# Altium project LimeSDR_1v2s.PrjPcb (part 2 of 4)

## Sheet 09_FPGA_misc.SchDoc: FPGA misc (power, clocks, config)
size A3; Organization: Lime Microsystems; Address1: Surrey Tech Centre; Address2: Guildford GU2 7YG; Address3: Surrey; Address4: United Kingdom; Revision: v1.2; SheetNumber: 9; SheetTotal: 14
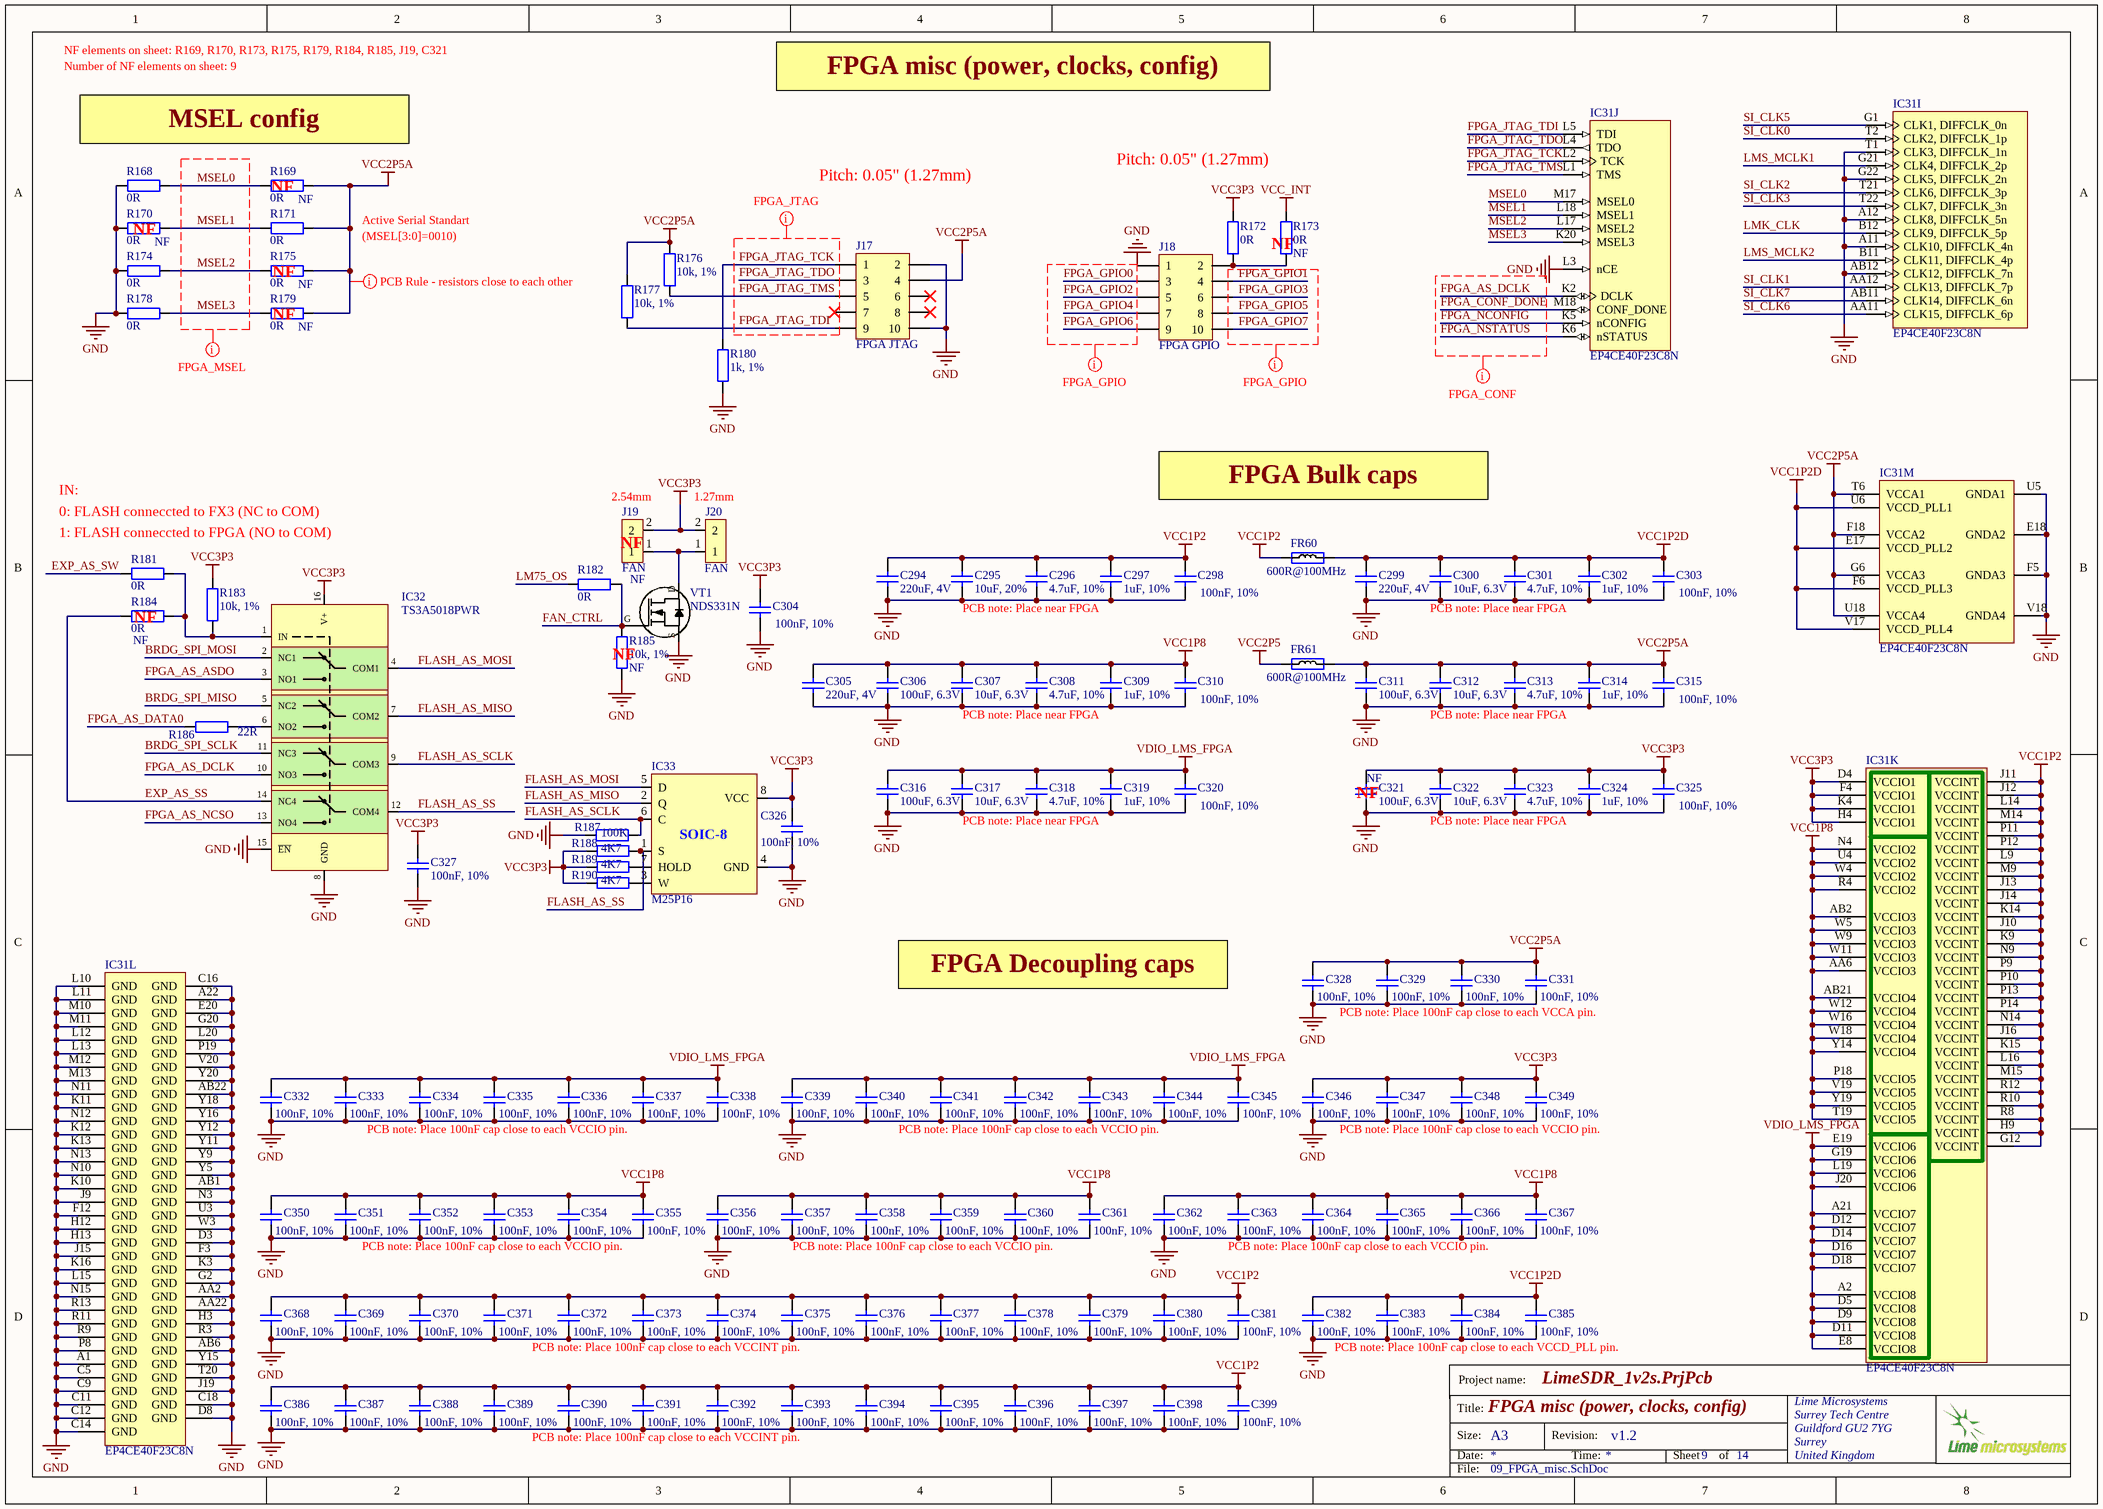
[diagram p7: 09_FPGA_misc.SchDoc]

### Parts
C294  220uF, 4V  [CAP1206]
C295  10uF, 20%  [CAP0603]
C296  4.7uF, 10%  [CAP0603]
C297  1uF, 10%  [CAP0402]
C298  100nF, 10%  [CAP0402]
C299  220uF, 4V  [CAP1206]
C300  10uF, 6.3V  [CAP0603]
C301  4.7uF, 10%  [CAP0603]
C302  1uF, 10%  [CAP0402]
C303  100nF, 10%  [CAP0402]
C304  100nF, 10%  [CAP0402]
C305  220uF, 4V  [CAP1206]
C306  100uF, 6.3V  [CAP1206]
C307  10uF, 6.3V  [CAP0603]
C308  4.7uF, 10%  [CAP0603]
C309  1uF, 10%  [CAP0402]
C310  100nF, 10%  [CAP0402]
C311  100uF, 6.3V  [CAP1206]
C312  10uF, 6.3V  [CAP0603]
C313  4.7uF, 10%  [CAP0603]
C314  1uF, 10%  [CAP0402]
C315  100nF, 10%  [CAP0402]
C316  100uF, 6.3V  [CAP1206]
C317  10uF, 6.3V  [CAP0603]
C318  4.7uF, 10%  [CAP0603]
C319  1uF, 10%  [CAP0402]
C320  100nF, 10%  [CAP0402]
C321  100uF, 6.3V  Assembly Info: NF  [CAP1206]
C322  10uF, 6.3V  [CAP0603]
C323  4.7uF, 10%  [CAP0603]
C324  1uF, 10%  [CAP0402]
C325  100nF, 10%  [CAP0402]
C326  100nF, 10%  [CAP0402]
C327  100nF, 10%  [CAP0402]
C328  100nF, 10%  [CAP0402]
C329  100nF, 10%  [CAP0402]
C330  100nF, 10%  [CAP0402]
C331  100nF, 10%  [CAP0402]
C332  100nF, 10%  [CAP0402]
C333  100nF, 10%  [CAP0402]
C334  100nF, 10%  [CAP0402]
C335  100nF, 10%  [CAP0402]
C336  100nF, 10%  [CAP0402]
C337  100nF, 10%  [CAP0402]
C338  100nF, 10%  [CAP0402]
C339  100nF, 10%  [CAP0402]
C340  100nF, 10%  [CAP0402]
C341  100nF, 10%  [CAP0402]
C342  100nF, 10%  [CAP0402]
C343  100nF, 10%  [CAP0402]
C344  100nF, 10%  [CAP0402]
C345  100nF, 10%  [CAP0402]
C346  100nF, 10%  [CAP0402]
C347  100nF, 10%  [CAP0402]
C348  100nF, 10%  [CAP0402]
C349  100nF, 10%  [CAP0402]
C350  100nF, 10%  [CAP0402]
C351  100nF, 10%  [CAP0402]
C352  100nF, 10%  [CAP0402]
C353  100nF, 10%  [CAP0402]
C354  100nF, 10%  [CAP0402]
C355  100nF, 10%  [CAP0402]
C356  100nF, 10%  [CAP0402]
C357  100nF, 10%  [CAP0402]
C358  100nF, 10%  [CAP0402]
C359  100nF, 10%  [CAP0402]
C360  100nF, 10%  [CAP0402]
C361  100nF, 10%  [CAP0402]
C362  100nF, 10%  [CAP0402]
C363  100nF, 10%  [CAP0402]
C364  100nF, 10%  [CAP0402]
C365  100nF, 10%  [CAP0402]
C366  100nF, 10%  [CAP0402]
C367  100nF, 10%  [CAP0402]
C368  100nF, 10%  [CAP0402]
C369  100nF, 10%  [CAP0402]
C370  100nF, 10%  [CAP0402]
C371  100nF, 10%  [CAP0402]
C372  100nF, 10%  [CAP0402]
C373  100nF, 10%  [CAP0402]
C374  100nF, 10%  [CAP0402]
C375  100nF, 10%  [CAP0402]
C376  100nF, 10%  [CAP0402]
C377  100nF, 10%  [CAP0402]
C378  100nF, 10%  [CAP0402]
C379  100nF, 10%  [CAP0402]
C380  100nF, 10%  [CAP0402]
C381  100nF, 10%  [CAP0402]
C382  100nF, 10%  [CAP0402]
C383  100nF, 10%  [CAP0402]
C384  100nF, 10%  [CAP0402]
C385  100nF, 10%  [CAP0402]
C386  100nF, 10%  [CAP0402]
C387  100nF, 10%  [CAP0402]
C388  100nF, 10%  [CAP0402]
C389  100nF, 10%  [CAP0402]
C390  100nF, 10%  [CAP0402]
C391  100nF, 10%  [CAP0402]
C392  100nF, 10%  [CAP0402]
C393  100nF, 10%  [CAP0402]
C394  100nF, 10%  [CAP0402]
C395  100nF, 10%  [CAP0402]
C396  100nF, 10%  [CAP0402]
C397  100nF, 10%  [CAP0402]
C398  100nF, 10%  [CAP0402]
C399  100nF, 10%  [CAP0402]
FR60  600R@100MHz  [RES0805]
FR61  600R@100MHz  [RES0805]
IC31  EP4CE40F23C8N  [FBGA484_A-240]  (parts I,J,K,L,M of 13)
IC32  TS3A5018PWR  [TS3A5018PWR]
IC33  M25P16  [M25P40-VMN6TPB_SO8N]
J17  FPGA JTAG  [SWD_10_pin]
J18  FPGA GPIO  [SWD_10_pin]
J19  FAN  Assembly Info: NF  [HDR_1x2]
J20  FAN  [HDR_1x2_HALF_PITCH]
R168  0R  [RES0402]
R169  0R  Assembly Info: NF  [RES0402]
R170  0R  Assembly Info: NF  [RES0402]
R171  0R  [RES0402]
R172  0R  [RES0402]
R173  0R  Assembly Info: NF  [RES0402]
R174  0R  [RES0402]
R175  0R  Assembly Info: NF  [RES0402]
R176  10k, 1%  [RES0402]
R177  10k, 1%  [RES0402]
R178  0R  [RES0402]
R179  0R  Assembly Info: NF  [RES0402]
R180  1k, 1%  [RES0402]
R181  0R  [RES0402]
R182  0R  [RES0402]
R183  10k, 1%  [RES0402]
R184  0R  Assembly Info: NF  [RES0402]
R185  10k, 1%  Assembly Info: NF  [RES0402]
R186  22R  [RES0402]
R187  100K  [RES0402]
R188  4K7  [RES0402]
R189  4K7  [RES0402]
R190  4K7  [RES0402]
VT1  NDS331N  [SOT23-3]

### Nets
GND: C294.1 C295.1 C296.1 C297.2 C298.2 C299.1 C300.1 C301.1 C302.2 C303.2 C304.2 C305.1 C306.1 C307.1 C308.1 C309.1 C310.2 C311.1 C312.1 C313.1 C314.1 C315.2 C316.1 C317.1 C318.1 C319.1 C320.2 C321.1 C322.1 C323.1 C324.1 C325.2 C326.2 C327.2 C328.2 C329.2 C330.2 C331.2 C332.2 C333.2 C334.2 C335.2 C336.2 C337.2 C338.2 C339.2 C340.2 C341.2 C342.2 C343.2 C344.2 C345.2 C346.2 C347.2 C348.2 C349.2 C350.2 C351.2 C352.2 C353.2 C354.2 C355.2 C356.2 C357.2 C358.2 C359.2 C360.2 C361.2 C362.2 C363.2 C364.2 C365.2 C366.2 C367.2 C368.2 C369.2 C370.2 C371.2 C372.2 C373.2 C374.2 C375.2 C376.2 C377.2 C378.2 C379.2 C380.2 C381.2 C382.2 C383.2 C384.2 C385.2 C386.2 C387.2 C388.2 C389.2 C390.2 C391.2 C392.2 C393.2 C394.2 C395.2 C396.2 C397.2 C398.2 C399.2 IC31.A1(GND) IC31.A11(CLK10,_DIFFCLK_4n) IC31.A12(CLK8,_DIFFCLK_5n) IC31.A22(GND) IC31.AA2(GND) IC31.AA22(GND) IC31.AB1(GND) IC31.AB6(GND) IC31.AB12(CLK12,_DIFFCLK_7n) IC31.AB22(GND) IC31.C5(GND) IC31.C9(GND) IC31.C11(GND) IC31.C12(GND) IC31.C14(GND) IC31.C16(GND) IC31.C18(GND) IC31.D3(GND) IC31.D8(GND) IC31.E18(GNDA2) IC31.E20(GND) IC31.F3(GND) IC31.F5(GNDA3) IC31.F12(GND) IC31.G2(GND) IC31.G20(GND) IC31.G22(CLK5,_DIFFCLK_2n) IC31.H3(GND) IC31.H12(GND) IC31.H13(GND) IC31.J9(GND) IC31.J15(GND) IC31.J19(GND) IC31.K3(GND) IC31.K10(GND) IC31.K11(GND) IC31.K12(GND) IC31.K13(GND) IC31.K16(GND) IC31.L3(nCE) IC31.L10(GND) IC31.L11(GND) IC31.L12(GND) IC31.L13(GND) IC31.L15(GND) IC31.L20(GND) IC31.M10(GND) IC31.M11(GND) IC31.M12(GND) IC31.M13(GND) IC31.N3(GND) IC31.N10(GND) IC31.N11(GND) IC31.N12(GND) IC31.N13(GND) IC31.N15(GND) IC31.P8(GND) IC31.P19(GND) IC31.R3(GND) IC31.R9(GND) IC31.R11(GND) IC31.R13(GND) IC31.T1(CLK3,_DIFFCLK_1n) IC31.T20(GND) IC31.U3(GND) IC31.U5(GNDA1) IC31.V18(GNDA4) IC31.V20(GND) IC31.W3(GND) IC31.Y5(GND) IC31.Y9(GND) IC31.Y11(GND) IC31.Y12(GND) IC31.Y15(GND) IC31.Y16(GND) IC31.Y18(GND) IC31.Y20(GND) IC32.8(GND) IC32.15(~{EN}) IC33.4(GND) J17.2 J17.10 J18.1 R168.2 R170.2 R174.2 R178.2 R180.2 R185.2 R187.2 VT1.S
VCC1P2: C294.2 C295.2 C296.2 C297.1 C298.1 C368.1 C369.1 C370.1 C371.1 C372.1 C373.1 C374.1 C375.1 C376.1 C377.1 C378.1 C379.1 C380.1 C381.1 C386.1 C387.1 C388.1 C389.1 C390.1 C391.1 C392.1 C393.1 C394.1 C395.1 C396.1 C397.1 C398.1 C399.1 FR60.1 IC31.G12(VCCINT) IC31.H9(VCCINT) IC31.J10(VCCINT) IC31.J11(VCCINT) IC31.J12(VCCINT) IC31.J13(VCCINT) IC31.J14(VCCINT) IC31.J16(VCCINT) IC31.K9(VCCINT) IC31.K14(VCCINT) IC31.K15(VCCINT) IC31.L9(VCCINT) IC31.L14(VCCINT) IC31.L16(VCCINT) IC31.M9(VCCINT) IC31.M14(VCCINT) IC31.M15(VCCINT) IC31.N9(VCCINT) IC31.N14(VCCINT) IC31.P9(VCCINT) IC31.P10(VCCINT) IC31.P11(VCCINT) IC31.P12(VCCINT) IC31.P13(VCCINT) IC31.P14(VCCINT) IC31.R8(VCCINT) IC31.R10(VCCINT) IC31.R12(VCCINT)
VCC1P2D: C299.2 C300.2 C301.2 C302.1 C303.1 C382.1 C383.1 C384.1 C385.1 FR60.2 IC31.E17(VCCD_PLL2) IC31.F6(VCCD_PLL3) IC31.U6(VCCD_PLL1) IC31.V17(VCCD_PLL4)
VCC1P8: C305.2 C306.2 C307.2 C308.2 C309.2 C310.1 C350.1 C351.1 C352.1 C353.1 C354.1 C355.1 C356.1 C357.1 C358.1 C359.1 C360.1 C361.1 C362.1 C363.1 C364.1 C365.1 C366.1 C367.1 IC31.AA6(VCCIO3) IC31.AB2(VCCIO3) IC31.AB21(VCCIO4) IC31.N4(VCCIO2) IC31.P18(VCCIO5) IC31.R4(VCCIO2) IC31.T19(VCCIO5) IC31.U4(VCCIO2) IC31.V19(VCCIO5) IC31.W4(VCCIO2) IC31.W5(VCCIO3) IC31.W9(VCCIO3) IC31.W11(VCCIO3) IC31.W12(VCCIO4) IC31.W16(VCCIO4) IC31.W18(VCCIO4) IC31.Y14(VCCIO4) IC31.Y19(VCCIO5)
VCC2P5: FR61.1
VCC2P5A: C311.2 C312.2 C313.2 C314.2 C315.1 C328.1 C329.1 C330.1 C331.1 FR61.2 IC31.F18(VCCA2) IC31.G6(VCCA3) IC31.T6(VCCA1) IC31.U18(VCCA4) J17.4 R169.1 R171.1 R175.1 R176.2 R177.2 R179.1
VCC3P3: C304.1 C321.2 C322.2 C323.2 C324.2 C325.1 C326.1 C327.1 C346.1 C347.1 C348.1 C349.1 IC31.D4(VCCIO1) IC31.F4(VCCIO1) IC31.H4(VCCIO1) IC31.K4(VCCIO1) IC32.16(V+) IC33.8(VCC) J19.2 J20.2 R172.1 R183.1 R188.1 R189.1 R190.1
VCC_INT: R173.1
VDIO_LMS_FPGA: C316.2 C317.2 C318.2 C319.2 C320.1 C332.1 C333.1 C334.1 C335.1 C336.1 C337.1 C338.1 C339.1 C340.1 C341.1 C342.1 C343.1 C344.1 C345.1 IC31.A2(VCCIO8) IC31.A21(VCCIO7) IC31.D5(VCCIO8) IC31.D9(VCCIO8) IC31.D11(VCCIO8) IC31.D12(VCCIO7) IC31.D14(VCCIO7) IC31.D16(VCCIO7) IC31.D18(VCCIO7) IC31.E8(VCCIO8) IC31.E19(VCCIO6) IC31.G19(VCCIO6) IC31.J20(VCCIO6) IC31.L19(VCCIO6)
BRDG_SPI_MISO: IC32.5(NC2)
BRDG_SPI_MOSI: IC32.2(NC1)
BRDG_SPI_SCLK: IC32.11(NC3)
EXP_AS_SS: IC32.14(NC4) R184.2
EXP_AS_SW: R181.2
FAN_CTRL: R182.2 R185.1 VT1.G
FLASH_AS_MISO: IC32.7(COM2) IC33.2(Q)
FLASH_AS_MOSI: IC32.4(COM1) IC33.5(D)
FLASH_AS_SCLK: IC32.9(COM3) IC33.6(C) R187.1
FLASH_AS_SS: IC32.12(COM4) IC33.1(S) R188.2
FPGA_AS_ASDO: IC32.3(NO1)
FPGA_AS_DATA0: R186.2
FPGA_AS_DCLK: IC31.K2(DCLK) IC32.10(NO3)
FPGA_AS_NCSO: IC32.13(NO4)
FPGA_CONF_DONE: IC31.M18(CONF_DONE)
FPGA_GPIO0: J18.3
FPGA_GPIO1: J18.4
FPGA_GPIO2: J18.5
FPGA_GPIO3: J18.6
FPGA_GPIO4: J18.7
FPGA_GPIO5: J18.8
FPGA_GPIO6: J18.9
FPGA_GPIO7: J18.10
FPGA_JTAG_TCK: IC31.L2(TCK) J17.1 R180.1
FPGA_JTAG_TDI: IC31.L5(TDI) J17.9 R177.1
FPGA_JTAG_TDO: IC31.L4(TDO) J17.3
FPGA_JTAG_TMS: IC31.L1(TMS) J17.5 R176.1
FPGA_NCONFIG: IC31.K5(nCONFIG)
FPGA_NSTATUS: IC31.K6(nSTATUS)
LM75_OS: R182.1
LMK_CLK: IC31.B12(CLK9,_DIFFCLK_5p)
LMS_MCLK1: IC31.G21(CLK4,_DIFFCLK_2p)
LMS_MCLK2: IC31.B11(CLK11,_DIFFCLK_4p)
MSEL0: IC31.M17(MSEL0) R168.1 R169.2
MSEL1: IC31.L18(MSEL1) R170.1 R171.2
MSEL2: IC31.L17(MSEL2) R174.1 R175.2
MSEL3: IC31.K20(MSEL3) R178.1 R179.2
SI_CLK0: IC31.T2(CLK2,_DIFFCLK_1p)
SI_CLK1: IC31.AA12(CLK13,_DIFFCLK_7p)
SI_CLK2: IC31.T21(CLK6,_DIFFCLK_3p)
SI_CLK3: IC31.T22(CLK7,_DIFFCLK_3n)
SI_CLK5: IC31.G1(CLK1,_DIFFCLK_0n)
SI_CLK6: IC31.AA11(CLK15,_DIFFCLK_6p)
SI_CLK7: IC31.AB11(CLK14,_DIFFCLK_6n)
NetIC32_1: IC32.1(IN) R181.1 R183.2 R184.1
NetIC32_6: IC32.6(NO2) R186.1
NetIC33_3: IC33.3(W) R190.2
NetIC33_7: IC33.7(HOLD) R189.2
NetJ18_2: J18.2 R172.2 R173.2
NetJ19_1: J19.1 J20.1 VT1.D

Not connected (* = marked no-connect by the designer): J17 6* 7* 8*

### Layout directives
rule Undefined: VCC2P5A
net class FPGA_MSEL: MSEL0, MSEL1, MSEL2, MSEL3
net class FPGA_GPIO: FPGA_GPIO0, FPGA_GPIO1, FPGA_GPIO2, FPGA_GPIO3, FPGA_GPIO4, FPGA_GPIO5, FPGA_GPIO6, FPGA_GPIO7
net class FPGA_JTAG: FPGA_JTAG_TCK, FPGA_JTAG_TDI, FPGA_JTAG_TDO, FPGA_JTAG_TMS
net class FPGA_CONF: FPGA_AS_DCLK, FPGA_CONF_DONE, FPGA_NCONFIG, FPGA_NSTATUS

### Notes on the sheet
- NF elements on sheet: R169, R170, R173, R175, R179, R184, R185, J19, C321
- Number of NF elements on sheet: 9
- FPGA misc (power, clocks, config)
- MSEL config
- Pitch: 0.05" (1.27mm)
- (near R170) NF
- (near R169) NF
- Active Serial Standart
- (MSEL[3:0]=0010)
- (near R173) NF
- (near R175) NF
- (near R179) NF
- 0: FLASH conneccted to FX3 (NC to COM)
- IN:
- (near J19) 2.54mm
- (near J20) 1.27mm
- FPGA Bulk caps
- 1: FLASH conneccted to FPGA (NO to COM)
- (near J19) NF
- (near R184) NF
- PCB note: Place near FPGA
- (near R185) NF
- (near C321) NF
- FPGA Decoupling caps
- PCB note: Place 100nF cap close to each VCCA pin.
- PCB note: Place 100nF cap close to each VCCIO pin.
- PCB note: Place 100nF cap close to each VCCINT pin.
- PCB note: Place 100nF cap close to each VCCD_PLL pin.
- Project name:
- Title:
- Size:
- Date:
- A3
- Revision:
- Time:
- Sheet
- of
- File:
- (in symbol M25P40) SOIC-8

### Library data of the parts
C294 C299 C305 = Cap_1206: Manufacturer Part Number: GRM31CR60G227ME11L; Manufacturer: Murata Electronics North America; Part Description: 220µF ±20% 4V X5R Ceramic Capacitor -55°C ~ 85°C Surface Mount, MLCC 1206 (3216 Metric) 0.126" L x 0.063" W (3.20mm x 1.60mm); Capacitance: 220µF; Temperature Coefficient: X5R; Tolerance: ±20%; Package / Case: 1206 (3216 Metric); Supplier 1: Digi-Key; Packaging: Cut Tape (CT); Size / Dimension: 0.126" L x 0.063" W (3.20mm x 1.60mm); Operating Temperature: -55°C ~ 85°C; Voltage - Rated: 4V; Mounting Type: Surface Mount, MLCC; Ratings: -; Supplier Part Number 1: 490-9774-1-ND; Category: Capacitors; Lead Spacing: -; Lead Style: -; Applications: General Purpose; Features: -; Height - Seated (Max): -; Thickness (Max): 0.075" (1.90mm); RoHS: RoHS Compliant; Value: 220uF, 4V
C295 = Cap_0603: Manufacturer: Yageo; Manufacturer Part Number 1: GRM188R61C106MA73D; Part Description: 10µF ±20% 16V X5R Ceramic Capacitor -55°C ~ 85°C Surface Mount, MLCC 0603 (1608 Metric) 0.063" L x 0.031" W (1.60mm x 0.80mm); Temperature Coefficient: X5R; Capacitance: 10µF; Voltage - Rated: 16V; Value: 10uF, 20%; Supplier 1: Digi-Key; Supplier Part Number 1: 490-7201-2-ND; Category: Capacitors; Ratings: -; Features: -; Lead Style: -; Package / Case: 0603 (1608 Metric); Lead Spacing: -; Applications: General Purpose; Operating Temperature: -55°C ~ 85°C; Tolerance: ±20%; Thickness (Max): 0.039" (1.00mm); Mounting Type: Surface Mount, MLCC; RoHS: RoHS Compliant; Size / Dimension: 0.063" L x 0.031" W (1.60mm x 0.80mm); Packaging: Tape & Reel (TR); Height - Seated (Max): -
C296 C301 C308 C313 C318 C323 = Cap_0603: Manufacturer Part Number 1: CGB3B1X5R1A475K055AC; Part Description: 4.7µF ±10% 10V X5R Ceramic Capacitor -55°C ~ 85°C Surface Mount, MLCC 0603 (1608 Metric) 0.063" L x 0.031" W (1.60mm x 0.80mm); Voltage Rating DC: 10 V; Temperature Coefficient / Code: +/- 15 %; Supplier 1: Mouser; Supplier Part Number 1: 810-CGB3B1X5R1A475KC; Capacitance: 4.7 uF; Operating Temperature Range: - 55 C to + 85 C; Category: Multilayer Ceramic Capacitors MLCC - SMD/SMT; Case Code - in: 0603; Package / Case: 0603 (1608 metric); Tolerance: 10 %; value: 4.7uF, 10%
C297 C302 C309 C314 C319 C324 = Cap_0402: Manufacturer Part Number 1: GRM155R61A105KE15J; Manufacturer: TDK; Part Description: 1µF ±10% 10V X5R Ceramic Capacitor -55°C ~ 85°C Surface Mount, MLCC 0402 (1005 Metric) 0.039" L x 0.020" W (1.00mm x 0.50mm); Voltage Rating: 10; Product Range: TDK - C Series; Ceramic Capacitor Case: 0402 [1005 Metric]; Capacitance: 1; Dielectric Characteristic: X6; Value: 1uF, 10%; Supplier 1: Newark; Supplier Part Number 1: 490-6298-2-ND; Capacitance Tolerance: ± 10%; MSL: -; RoHS: YES
C298 C303 C304 C310 C315 C320 C325-C399 = Cap_0603: Manufacturer Part Number 1: GRM155R71C104KA88D; Part Description: 0.10µF ±10% 16V X7R Ceramic Capacitor -55°C ~ 125°C Surface Mount, MLCC 0402 (1005 Metric) 0.039" L x 0.020" W (1.00mm x 0.50mm); Brand: Murata Electronics; Type: General Purpose MLCC; Capacitance: 0.1 uF; Temperature Coefficient / Code: +/- 15 %; Voltage Rating DC: 16 V; Supplier 1: Mouser; Supplier Part Number 1: 81-GRM155R71C104KA88; Tolerance: 10 %; Case Code - in: 0402; Manufacturer: Murata Electronics; Category: Multilayer Ceramic Capacitors MLCC - SMD/SMT; Value: 100nF, 10%; Manufacturer Part Number: GRM155R71C104KA88D
C300 C307 C312 C317 C322 = Cap_0603: Manufacturer Part Number 1: CC0603MRX5R5BB106; Part Description: 10µF ±20% 6.3V X5R Ceramic Capacitor -55°C ~ 85°C Surface Mount, MLCC 0603 (1608 Metric) 0.063" L x 0.031" W (1.60mm x 0.80mm); Manufacturer: Yageo; Capacitance: 10µF; Tolerance: ±20%; Supplier 1: Digi-Key; Supplier Part Number 1: 311-1448-2-ND; Package / Case: 0603 (1608 Metric); Category: Capacitors; Voltage - Rated: 6.3V; Value: 10uF, 6.3V
C306 C311 C316 C321 = Cap_1206: Manufacturer: MURATA; Manufacturer Part Number 1: GRM31CR60J107ME39L.; Part Description: 100µF ±20% 6.3V X5R Ceramic Capacitor -55°C ~ 85°C Surface Mount, MLCC 1206 (3216 Metric) 0.126" L x 0.063" W (3.20mm x 1.60mm); Capacitance Tolerance: ± 20%; Ceramic Capacitor Case: 1206 [3216 Metric]; Voltage Rating: 6.3; value: 100uF, 6.3V; Supplier Part Number 1: 1735535; Supplier 1: Farnell
FR60 FR61 = Ferrite: Manufacturer Part Number 1: MPZ2012S601AT000; Manufacturer: TDK Corporation; Part Description: FERRITE BEAD 600 OHM 0805 1LN; Filter Type: Differential Mode - Single; Impedance @ Frequency: 600 Ohm @ 100MHz; DC Resistance (DCR): 100 mOhm Max; Current Rating: 2A; Supplier 1: Digi-Key; Supplier Part Number 1: 445-2206-2-ND; Mounting Type: Surface Mount; RoHS: RoHS Compliant; Height (Max): 0.041" (1.05mm); Packaging: Tape & Reel (TR); Category: Filters; Package / Case: 0805 (2012 Metric); Size / Dimension: 0.079" L x 0.049" W (2.00mm x 1.25mm)
IC31 = EP4CE40F23C7N: IC FPGA 328 I/O 484FBGA; Manufacturer: Altera; Number of I/O: 328; Number of LABs/CLBs: 2475; Number of Logic Elements/Cells: 39600; Total RAM Bits: 1161216; Voltage - Supply: 1.15 V ~ 1.25 V; DatasheetVersion: ver1.6, Nov-2011; PackageDescription: 484-Pin FineLine Ball Grid Array (FBGA) - Wire Bond - A:2.40; Code_JEDEC: MS-034-AAJ-1; ComponentLink1Description: Manufacturer URL; ComponentLink1URL: http://www.altera.com/; ComponentLink2Description: Handbook; ComponentLink2URL: http://www.altera.com/literature/hb/cyclone-iv/cyclone4-handbook.pdf; ComponentLink3Description: Pinout; ComponentLink3URL: http://www.altera.com/literature/lit-dp.jsp?category=cyc%204&showspreadsheet=y; ComponentLink4Description: Package Specification; ComponentLink4URL: http://www.altera.com/devicepackaging/04R00247-02.pdf; Category: Integrated Circuits (ICs); Manufacturer Part Number 1: EP4CE40F23C8N; Mounting Type: Surface Mount; Number of Gates: -; Operating Temperature: 0°C ~ 85°C; Package / Case: 484-BGA; RoHS: RoHS Compliant; Supplier 1: Digi-Key; Supplier Device Package: 484-FBGA (23x23); Supplier Part Number 1: 544-2811-ND; Part Description: IC FPGA 328 I/O 484FBGA
IC32 = TS3A5018PWR: Manufacturer: TEXAS INSTRUMENTS; Part Description: IC SWITCH QUAD SPDT 16TSSOP; On State Resistance Max: 10; Analog Switch Case: TSSOP; Supply Voltage Range: 2.3V to 3.6; No. of Pins: 16; Analog Switch Type: SPDT; Supplier 1: Newark; Manufacturer Part Number 1: TS3A5018PW; Supplier Part Number 1: 71J8329
IC33 = M25P40: Manufacturer Part Number 1: M25P16-VMN6P; Manufacturer: Micron Technology Inc.; Part Description: IC FLASH 16MBIT 75MHZ 8SO; Supply Voltage Min: 2.7; Supply Voltage Max: 3.6; Memory Case Style: NSOIC; Memory Type: Flash; Memory Size: 16; Flash Memory Configuration: 2M x 8; No. of Pins: 8; Clock Frequency: 75; IC Interface Type: Serial, SPI; Page / Burst Read Access: 0.8; Supply Voltage Range: 2.7V to 3.6; Supplier 1: Farnell; Supplier Part Number 1: 1734973; RoHS: YES; Access Time: -; Operating Temperature Min: -40; Operating Temperature Max: 85; Packaging: Each; MSL: MSL 3 - 168 hours; Memory Voltage Vcc: 3.6; Operating Temperature Range: -40°C to +85
J17 J18 = Header 5X2_SWD: Header, 5-Pin, Dual row; Manufacturer Part Number 1: M50-3600542; Manufacturer: Harwin Inc; Part Description: CONN HDR 1.27MM SMD AU 10POS; Number of Positions: 10; Molding Height Above Board: 0.039" (1.00mm); Row Spacing: 0.050" (1.27mm); Number of Positions Loaded: All; Connector Type: Unshrouded; Supplier 1: Digi-Key; Contact Mating Length: 0.118" (3.00mm); Category: Connectors, Interconnects; Color: Black; RoHS: RoHS Compliant; Number of Rows: 2; Contact Finish Thickness: 3µin (0.08µm); Height Stacking (Mating): -; Contact Finish: Gold; Termination: Solder; Mounting Type: Surface Mount; Pitch: 0.050" (1.27mm); Features: -; Packaging: Bulk; Supplier Part Number 1: 952-1389-ND
J19 = Jumper: Manufacturer Part Number 1: 961102-6404-AR; Part Description: 2 Positions Header, Unshrouded Connector 0.100" (2.54mm) Through Hole Gold; Connector Type: Header, Unshrouded; Supplier 1: Digi-Key; Supplier Part Number 1: 3M9447-ND; Contact Type: Male Pin; Color: Black; Mounting Type: Through Hole; Category: Connectors, Interconnects; Contact Finish: Gold
J20 = Jumper: Manufacturer Part Number 1: GRPB021VWVN-RC; Manufacturer: Sullins Connector Solutions; Part Description: CONN SHUNT 1.27MM BLUE W/HANDLE; Connector Type: Header, Unshrouded; Number of Positions: 2; Number of Positions Loaded: All; Pitch: 0.050" (1.27mm); Supplier 1: Digi-Key; Supplier Part Number 1: S9014E-02-ND; Contact Mating Length: 0.118" (3.00mm); Mounting Type: Through Hole; Termination: Solder; Fastening Type: -; Features: -; Contact Finish: Gold; Contact Finish Thickness: Flash; Color: -; Category: Connectors, Interconnects; RoHS: RoHS Compliant; Packaging: Bulk; Contact Type: Male Pin; Number of Rows: 1; Row Spacing: -
R168-R175 R178 R179 R181 R182 R184 = Res_0402: Manufacturer: Yageo; Part Description: RES SMD 0.0OHM JUMPER 1/16W 0402; Supplier 1: Digi-Key; Supplier Part Number 1: 311-0.0JRTR-ND; Composition: Thick Film; Package / Case: 0402 (1005 Metric); Category: Resistors; Value: 0R
R176 R177 R183 R185 = Res_0402: Manufacturer: Yageo; Manufacturer Part Number 1: RC0402FR-0710KL; Part Description: RES SMD 10K OHM 1% 1/16W 0402; Temperature Coefficient: ±100ppm/°C; Power (Watts): 0.063W, 1/16W; Value: 10k, 1%; Supplier 1: Digi-Key; Supplier Part Number 1: 311-10.0KLRTR-ND; Resistance (Ohms): 10k; Packaging: Tape & Reel (TR); RoHS: RoHS Compliant; Package / Case: 0402 (1005 Metric); Tolerance: ±1%; Operating Temperature: -55°C ~ 155°C; Size / Dimension: 0.039" L x 0.020" W (1.00mm x 0.50mm); Number of Terminations: 2; Category: Resistors; Height: 0.016" (0.40mm); Supplier Device Package: 0402; Features: Moisture Resistant; Composition: Thick Film
R180 = Res_0402: Manufacturer: Stackpole Electronics Inc; Manufacturer Part Number 1: RMCF0402FT1K00; Part Description: RES SMD 1K OHM 1% 1/16W 0402; Temperature Coefficient: ±100ppm/°C; Power (Watts): 0.063W, 1/16W; Value: 1k, 1%; Supplier 1: Digi-Key; Supplier Part Number 1: RMCF0402FT1K00TR-ND; Package / Case: 0402 (1005 Metric); Supplier Device Package: 0402; Height: 0.016" (0.40mm); Size / Dimension: 0.039" L x 0.020" W (1.00mm x 0.50mm); Number of Terminations: 2; Packaging: Cut Tape (CT); Category: Resistors; Composition: Thick Film; Resistance (Ohms): 1k; Tolerance: ±1%; Features: Moisture Resistant; Operating Temperature: -55°C ~ 155°C; RoHS: RoHS Compliant
R186 = Res_0402: Part Description: RES SMD 22 OHM 1% 1/16W 0402; Tolerance: ±1%; Temperature Coefficient: ±100ppm/°C; Resistance (Ohms): 22; Supplier 1: Digi-Key; Supplier Part Number 1: 311-22.0LRTR-ND; Supplier Device Package: 0402; Composition: Thick Film; Category: Resistors; Value: 22R
R187 = Res_0402: Manufacturer Part Number 1: ERJ-2GEJ104X; Manufacturer: Panasonic Electronic Components; Part Description: RES SMD 100K OHM 5% 1/10W 0402; Tolerance: ±5%; Temperature Coefficient: ±200ppm/°C; Power (Watts): 0.1W, 1/10W; Supplier 1: Digi-Key; Supplier Part Number 1: P100KJCT-ND; Resistance (Ohms): 100k; Composition: Thick Film; Features: Automotive AEC-Q200; Number of Terminations: 2; Height: 0.016" (0.40mm); RoHS: RoHS Compliant; Package / Case: 0402 (1005 Metric); Packaging: Cut Tape (CT); Size / Dimension: 0.039" L x 0.020" W (1.00mm x 0.50mm); Supplier Device Package: 0402; Operating Temperature: -55°C ~ 155°C; Category: Resistors; value: 100K
R188-R190 = Res_0402: Manufacturer Part Number 1: RMCF0402JT4K70; Part Description: RES SMD 4.7K OHM 5% 1/16W 0402; Manufacturer: Stackpole Electronics Inc.; Temperature Coefficient: ±100ppm/°C; Resistance(Ohms): 4.7k; Tolerance: ±5%; Supplier 1: Digi-Key; Composition: Thick Film; Supplier Device Package: 0402; Supplier: Digi-Key; Supplier Part Number 1: RMCF0402JT4K70TR-ND; Category: Resistors; Value: 4K7
VT1 = NDS331N: Part Description: MOSFET N-CH 20V 1.3A SSOT3; Manufacturer: Fairchild Semiconductor; Gate Charge (Qg) @ Vgs: 5nC @ 4.5V; Power - Max: 460mW; Current - Continuous Drain (Id) @ 25°C: 1.3A (Ta); Input Capacitance (Ciss) @ Vds: 162pF @ 10V; FET Type: MOSFET N-Channel, Metal Oxide; Drain to Source Voltage (Vdss): 20V; FET Feature: Logic Level Gate; Supplier Device Package: 3-SSOT; Category: Discrete Semiconductor Products; Mounting Type: Surface Mount; Package / Case: TO-236-3, SC-59, SOT-23-3; Supplier 1: Digi-Key; Supplier Part Number 1: NDS331NCT-ND; Manufacturer Part Number 1: NDS331N

## Sheet 11_USB3_0_device.SchDoc: USB3.0 device
size A3; Organization: Lime Microsystems; Address1: Surrey Tech Centre; Address2: Guildford GU2 7YG; Address3: Surray; Address4: United Kingdom; Revision: v1.2; SheetNumber: 11; SheetTotal: 14
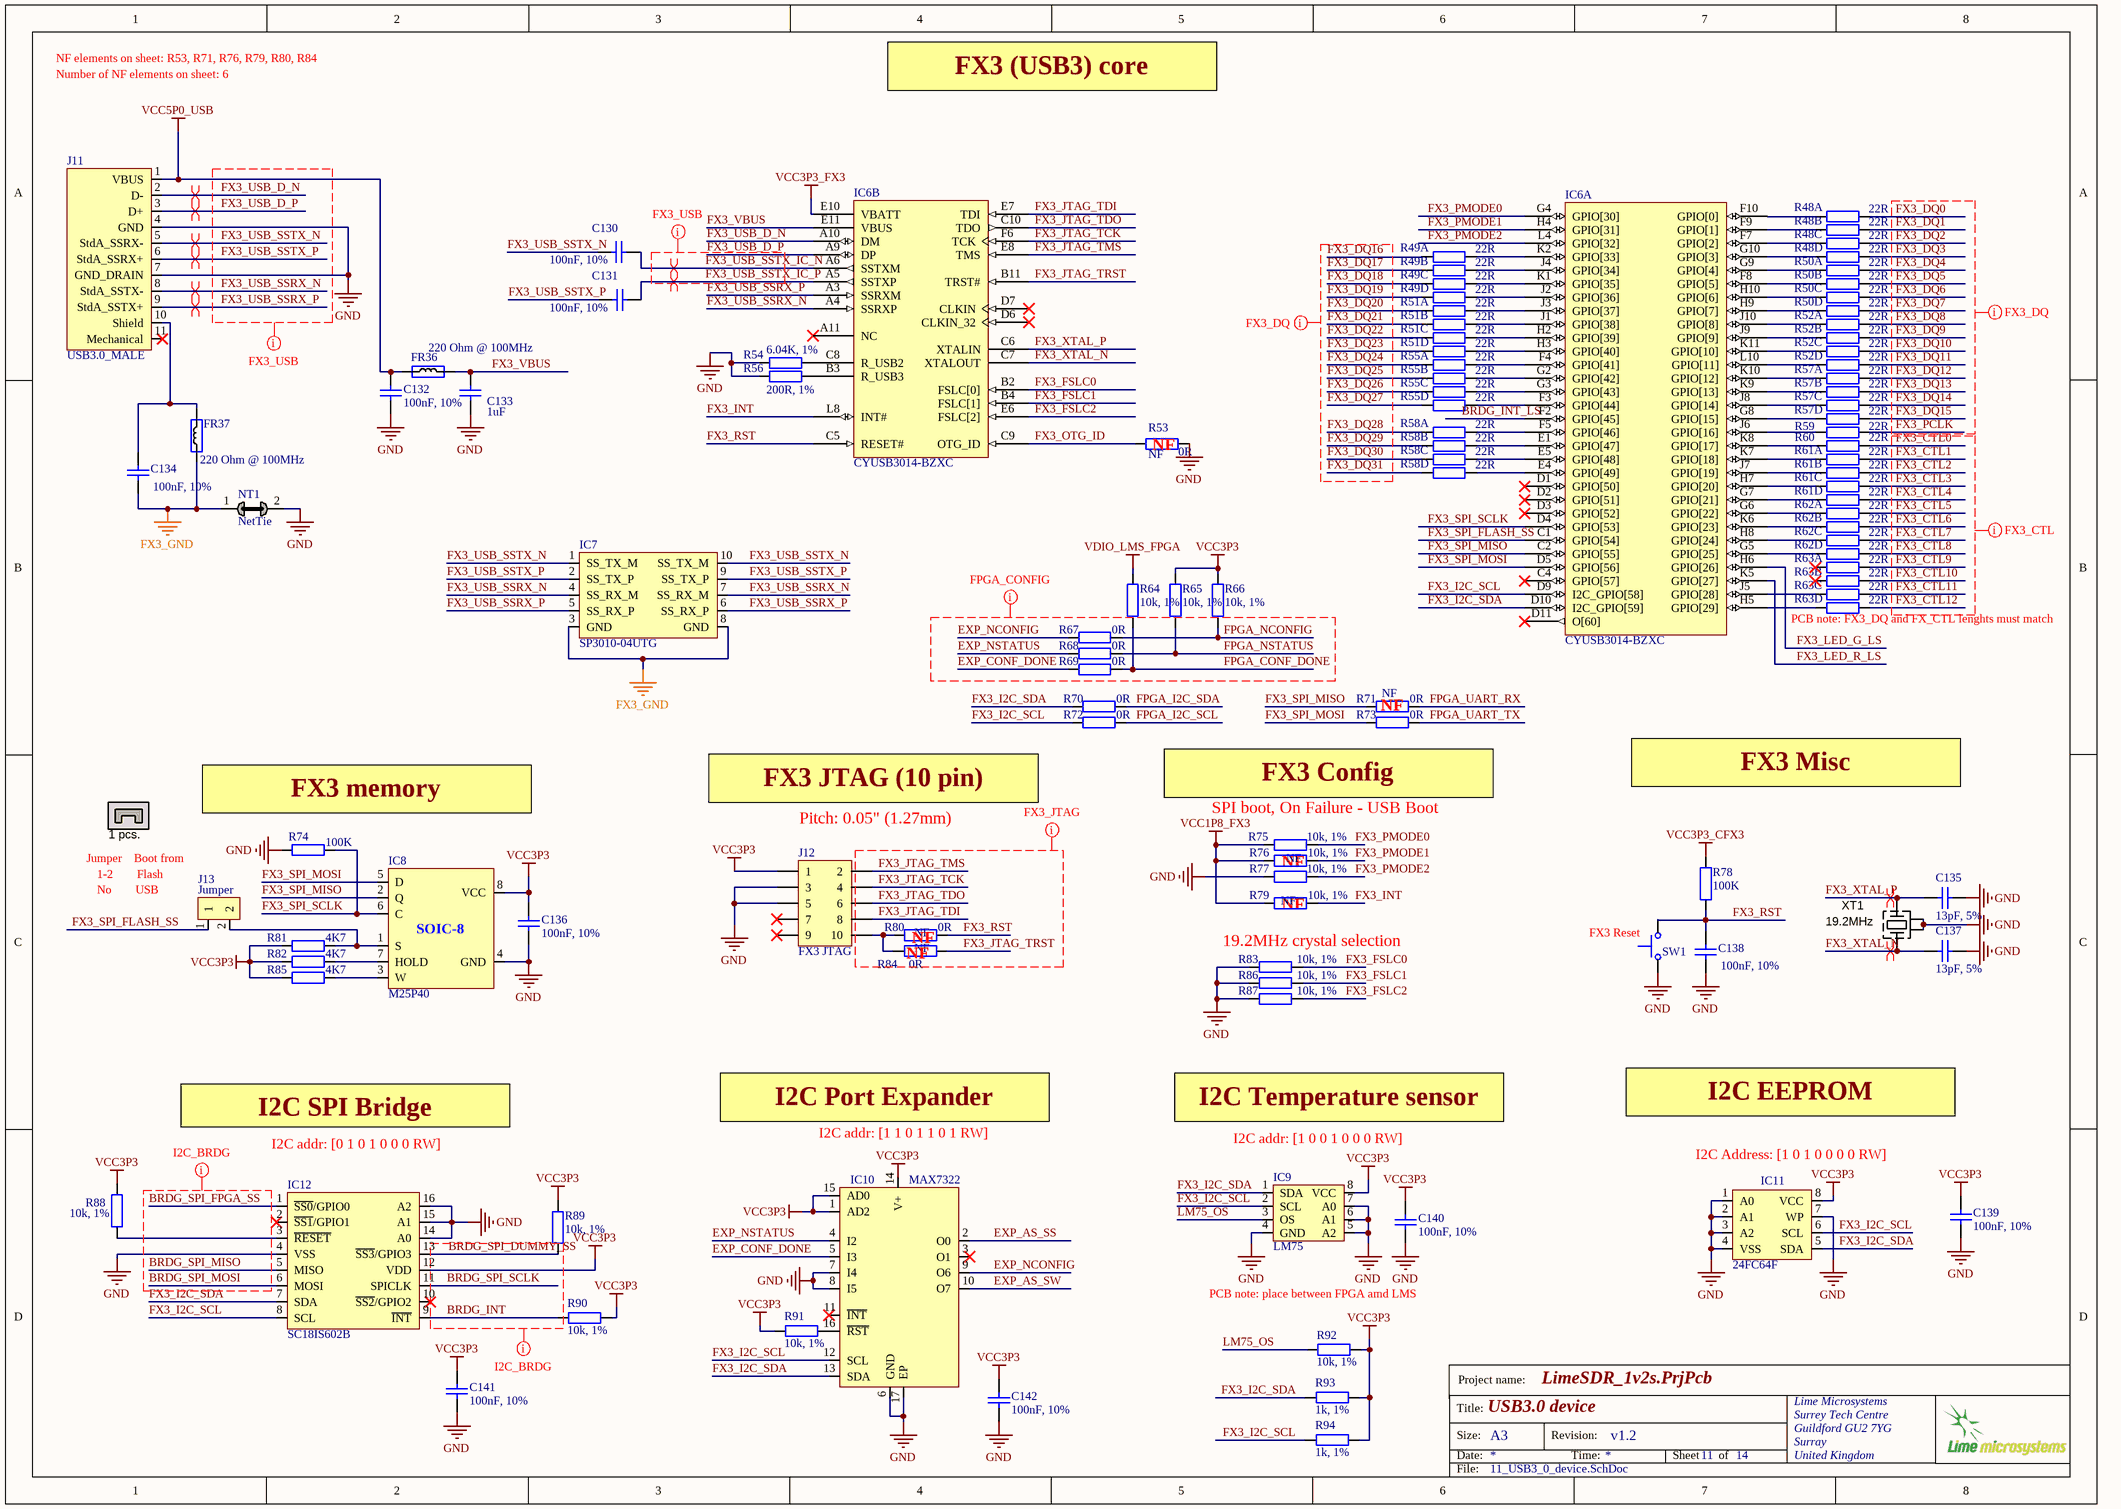
[diagram p8: 11_USB3_0_device.SchDoc]

### Parts
C130  100nF, 10%  [CAP0402]
C131  100nF, 10%  [CAP0402]
C132  100nF, 10%  [CAP0402]
C133  1uF  [CAP0603]
C134  100nF, 10%  [CAP0402]
C135  13pF, 5%  [CAP0402]
C136  100nF, 10%  [CAP0402]
C137  13pF, 5%  [CAP0402]
C138  100nF, 10%  [CAP0402]
C139  100nF, 10%  [CAP0402]
C140  100nF, 10%  [CAP0402]
C141  100nF, 10%  [CAP0402]
C142  100nF, 10%  [CAP0402]
FR36  220 Ohm @ 100MHz  [RES0402]
FR37  220 Ohm @ 100MHz  [RES0402]
IC6  CYUSB3014-BZXC  [CYP-BZX121]  (parts A,B of 3)
IC7  SP3010-04UTG  [SP3010-04UTG]
IC8  M25P40  [M25P40-VMN6TPB_SO8N]
IC9  LM75  [HWSON8_LM75]
IC10  MAX7322  [MAX7322ATE_QFN16]
IC11  24FC64F  [24FC512]
IC12  SC18IS602B  [SC18IS602B_TSSOP16]
J11  USB3.0_MALE  [USB3A_SM]
J12  FX3 JTAG  [SWD_10_pin]
J13  Jumper  [HDR_1x2_HALF_PITCH]
JMP1  1 pcs.  [MECH_JUMPER_HALF_PITCH]
NT1  NetTie  [NetTie_Wide2]  (net tie, no BOM)
R48  22R  [ChipResistorArray]  (parts A,B,C,D of 4)
R49  22R  [ChipResistorArray]  (parts A,B,C,D of 4)
R50  22R  [ChipResistorArray]  (parts A,B,C,D of 4)
R51  22R  [ChipResistorArray]  (parts A,B,C,D of 4)
R52  22R  [ChipResistorArray]  (parts A,B,C,D of 4)
R53  0R  Assembly Info: NF  [RES0402]
R54  6.04K, 1%  [RES0402]
R55  22R  [ChipResistorArray]  (parts A,B,C,D of 4)
R56  200R, 1%  [RES0402]
R57  22R  [ChipResistorArray]  (parts A,B,C,D of 4)
R58  22R  [ChipResistorArray]  (parts A,B,C,D of 4)
R59  22R  [RES0402]
R60  22R  [RES0402]
R61  22R  [ChipResistorArray]  (parts A,B,C,D of 4)
R62  22R  [ChipResistorArray]  (parts A,B,C,D of 4)
R63  22R  [ChipResistorArray]  (parts A,B,C,D of 4)
R64  10k, 1%  [RES0402]
R65  10k, 1%  [RES0402]
R66  10k, 1%  [RES0402]
R67  0R  [RES0402]
R68  0R  [RES0402]
R69  0R  [RES0402]
R70  0R  [RES0402]
R71  0R  Assembly Info: NF  [RES0402]
R72  0R  [RES0402]
R73  0R  [RES0402]
R74  100K  [RES0402]
R75  10k, 1%  [RES0402]
R76  10k, 1%  Assembly Info: NF  [RES0402]
R77  10k, 1%  [RES0402]
R78  100K  [RES0402]
R79  10k, 1%  Assembly Info: NF  [RES0402]
R80  0R  Assembly Info: NF  [RES0402]
R81  4K7  [RES0402]
R82  4K7  [RES0402]
R83  10k, 1%  [RES0402]
R84  0R  Assembly Info: NF  [RES0402]
R85  4K7  [RES0402]
R86  10k, 1%  [RES0402]
R87  10k, 1%  [RES0402]
R88  10k, 1%  [RES0402]
R89  10k, 1%  [RES0402]
R90  10k, 1%  [RES0402]
R91  10k, 1%  [RES0402]
R92  10k, 1%  [RES0402]
R93  1k, 1%  [RES0402]
R94  1k, 1%  [RES0402]
SW1  Switch, tactile  [SW_tactile]  (value not drawn)
XT1  19.2MHz  [CRYSTAL_4-LCC_v2]

### Nets
FX3_GND: C134.2 FR37.1 IC7.3(GND) IC7.8(GND) NT1.1
GND: C132.2 C133.1 C135.1 C136.2 C137.1 C138.2 C139.2 C140.2 C141.2 C142.2 IC8.4(GND) IC9.4(GND) IC9.5(A2) IC9.6(A1) IC9.7(A0) IC10.6(GND) IC10.7(I4) IC10.8(I5) IC10.17(EP) IC11.1(A0) IC11.2(A1) IC11.3(A2) IC11.4(VSS) IC11.7(WP) IC12.4(VSS) IC12.14(A0) IC12.15(A1) IC12.16(A2) J11.4(GND) J11.7(GND_DRAIN) J12.3 J12.5 NT1.2 R53.2 R54.1 R56.1 R74.1 R77.1 R83.1 R86.1 R87.1 SW1.1 XT1.2(GND) XT1.4(GND)
VCC1P8_FX3: R75.1 R76.1 R79.1
VCC3P3: C136.1 C139.1 C140.1 C141.1 C142.1 IC8.8(VCC) IC9.8(VCC) IC10.1(AD2) IC10.14(V+) IC10.15(AD0) IC11.8(VCC) IC12.12(VDD) J12.1 R65.1 R66.1 R81.1 R82.1 R85.1 R88.1 R89.2 R90.2 R91.1 R92.2 R93.1 R94.1
VCC3P3_CFX3: R78.2
VCC3P3_FX3: IC6.E10(VBATT)
VCC5P0_USB: C132.1 FR36.1 J11.1(VBUS)
VDIO_LMS_FPGA: R64.1
BRDG_INT: IC12.9(~{INT}) R90.1
BRDG_INT_LS: IC6.F2(GPIO[45])
BRDG_SPI_DUMMY_SS: IC12.13(~{SS3}/GPIO3) R89.1
BRDG_SPI_FPGA_SS: IC12.1(~{SS0}/GPIO0)
BRDG_SPI_MISO: IC12.5(MISO)
BRDG_SPI_MOSI: IC12.6(MOSI)
BRDG_SPI_SCLK: IC12.11(SPICLK)
EXP_AS_SS: IC10.2(O0)
EXP_AS_SW: IC10.10(O7)
EXP_CONF_DONE: IC10.5(I3) R69.1
EXP_NCONFIG: IC10.9(O6) R67.1
EXP_NSTATUS: IC10.4(I2) R68.1
FPGA_CONF_DONE: R64.2 R69.2
FPGA_I2C_SCL: R72.2
FPGA_I2C_SDA: R70.2
FPGA_NCONFIG: R66.2 R67.2
FPGA_NSTATUS: R65.2 R68.2
FPGA_UART_RX: R71.2
FPGA_UART_TX: R73.2
FX3_CTL0: R60.2
FX3_CTL1: R61.2
FX3_CTL2: R61.4
FX3_CTL3: R61.6
FX3_CTL4: R61.8
FX3_CTL5: R62.2
FX3_CTL6: R62.4
FX3_CTL7: R62.6
FX3_CTL8: R62.8
FX3_CTL9: R63.2
FX3_CTL10: R63.4
FX3_CTL11: R63.6
FX3_CTL12: R63.8
FX3_DQ0: R48.2
FX3_DQ1: R48.4
FX3_DQ2: R48.6
FX3_DQ3: R48.8
FX3_DQ4: R50.2
FX3_DQ5: R50.4
FX3_DQ6: R50.6
FX3_DQ7: R50.8
FX3_DQ8: R52.2
FX3_DQ9: R52.4
FX3_DQ10: R52.6
FX3_DQ11: R52.8
FX3_DQ12: R57.2
FX3_DQ13: R57.4
FX3_DQ14: R57.6
FX3_DQ15: R57.8
FX3_DQ16: R49.1
FX3_DQ17: R49.3
FX3_DQ18: R49.5
FX3_DQ19: R49.7
FX3_DQ20: R51.1
FX3_DQ21: R51.3
FX3_DQ22: R51.5
FX3_DQ23: R51.7
FX3_DQ24: R55.1
FX3_DQ25: R55.3
FX3_DQ26: R55.5
FX3_DQ27: R55.7
FX3_DQ28: R58.1
FX3_DQ29: R58.3
FX3_DQ30: R58.5
FX3_DQ31: R58.7
FX3_FSLC0: IC6.B2(FSLC[0]) R83.2
FX3_FSLC1: IC6.B4(FSLC[1]) R86.2
FX3_FSLC2: IC6.E6(FSLC[2]) R87.2
FX3_I2C_SCL: IC6.D9(I2C_GPIO[58]) IC9.2(SCL) IC10.12(SCL) IC11.6(SCL) IC12.8(SCL) R72.1 R94.2
FX3_I2C_SDA: IC6.D10(I2C_GPIO[59]) IC9.1(SDA) IC10.13(SDA) IC11.5(SDA) IC12.7(SDA) R70.1 R93.2
FX3_INT: IC6.L8(INT#) R79.2
FX3_JTAG_TCK: IC6.F6(TCK) J12.4
FX3_JTAG_TDI: IC6.E7(TDI) J12.8
FX3_JTAG_TDO: IC6.C10(TDO) J12.6
FX3_JTAG_TMS: IC6.E8(TMS) J12.2
FX3_JTAG_TRST: IC6.B11(TRST#) R84.1
FX3_LED_G_LS: IC6.H6(GPIO[26])
FX3_LED_R_LS: IC6.K5(GPIO[27])
FX3_OTG_ID: IC6.C9(OTG_ID) R53.1
FX3_PCLK: R59.1
FX3_PMODE0: IC6.G4(GPIO[30]) R75.2
FX3_PMODE1: IC6.H4(GPIO[31]) R76.2
FX3_PMODE2: IC6.L4(GPIO[32]) R77.2
FX3_RST: C138.1 IC6.C5(RESET#) R78.1 R80.2 SW1.2
FX3_SPI_FLASH_SS: IC6.C1(GPIO[54]) J13.1
FX3_SPI_MISO: IC6.C2(GPIO[55]) IC8.2(Q) R71.1
FX3_SPI_MOSI: IC6.D5(GPIO[56]) IC8.5(D) R73.1
FX3_SPI_SCLK: IC6.D4(GPIO[53]) IC8.6(C) R74.2
FX3_USB_D_N: IC6.A10(DM) J11.2(D-)
FX3_USB_D_P: IC6.A9(DP) J11.3(D+)
FX3_USB_SSRX_N: IC6.A4(SSRXP) IC7.4(SS_RX_M) IC7.7(SS_RX_M) J11.8(StdA_SSTX-)
FX3_USB_SSRX_P: IC6.A3(SSRXM) IC7.5(SS_RX_P) IC7.6(SS_RX_P) J11.9(StdA_SSTX+)
FX3_USB_SSTX_IC_N: C130.2 IC6.A6(SSTXM)
FX3_USB_SSTX_IC_P: C131.1 IC6.A5(SSTXP)
FX3_USB_SSTX_N: C130.1 IC7.1(SS_TX_M) IC7.10(SS_TX_M) J11.5(StdA_SSRX-)
FX3_USB_SSTX_P: C131.2 IC7.2(SS_TX_P) IC7.9(SS_TX_P) J11.6(StdA_SSRX+)
FX3_VBUS: C133.2 FR36.2 IC6.E11(VBUS)
FX3_XTAL_N: C137.2 IC6.C7(XTALOUT) XT1.3(X)
FX3_XTAL_P: C135.2 IC6.C6(XTALIN) XT1.1(X)
LM75_OS: IC9.3(OS) R92.1
NetC134_1: C134.1 FR37.2 J11.10(Shield)
NetIC6_B3: IC6.B3(R_USB3) R56.2
NetIC6_C8: IC6.C8(R_USB2) R54.2
NetIC6_E1: IC6.E1(GPIO[47]) R58.4
NetIC6_E4: IC6.E4(GPIO[49]) R58.8
NetIC6_E5: IC6.E5(GPIO[48]) R58.6
NetIC6_F3: IC6.F3(GPIO[44]) R55.8
NetIC6_F4: IC6.F4(GPIO[41]) R55.2
NetIC6_F5: IC6.F5(GPIO[46]) R58.2
NetIC6_F7: IC6.F7(GPIO[2]) R48.5
NetIC6_F8: IC6.F8(GPIO[5]) R50.3
NetIC6_F9: IC6.F9(GPIO[1]) R48.3
NetIC6_F10: IC6.F10(GPIO[0]) R48.1
NetIC6_G2: IC6.G2(GPIO[42]) R55.4
NetIC6_G3: IC6.G3(GPIO[43]) R55.6
NetIC6_G5: IC6.G5(GPIO[25]) R62.7
NetIC6_G6: IC6.G6(GPIO[22]) R62.1
NetIC6_G7: IC6.G7(GPIO[21]) R61.7
NetIC6_G8: IC6.G8(GPIO[15]) R57.7
NetIC6_G9: IC6.G9(GPIO[4]) R50.1
NetIC6_G10: IC6.G10(GPIO[3]) R48.7
NetIC6_H2: IC6.H2(GPIO[39]) R51.6
NetIC6_H3: IC6.H3(GPIO[40]) R51.8
NetIC6_H5: IC6.H5(GPIO[29]) R63.7
NetIC6_H7: IC6.H7(GPIO[20]) R61.5
NetIC6_H8: IC6.H8(GPIO[24]) R62.5
NetIC6_H9: IC6.H9(GPIO[7]) R50.7
NetIC6_H10: IC6.H10(GPIO[6]) R50.5
NetIC6_J1: IC6.J1(GPIO[38]) R51.4
NetIC6_J2: IC6.J2(GPIO[36]) R49.8
NetIC6_J3: IC6.J3(GPIO[37]) R51.2
NetIC6_J4: IC6.J4(GPIO[34]) R49.4
NetIC6_J5: IC6.J5(GPIO[28]) R63.5
NetIC6_J6: IC6.J6(GPIO[16]) R59.2
NetIC6_J7: IC6.J7(GPIO[19]) R61.3
NetIC6_J8: IC6.J8(GPIO[14]) R57.5
NetIC6_J9: IC6.J9(GPIO[9]) R52.3
NetIC6_J10: IC6.J10(GPIO[8]) R52.1
NetIC6_K1: IC6.K1(GPIO[35]) R49.6
NetIC6_K2: IC6.K2(GPIO[33]) R49.2
NetIC6_K6: IC6.K6(GPIO[23]) R62.3
NetIC6_K7: IC6.K7(GPIO[18]) R61.1
NetIC6_K8: IC6.K8(GPIO[17]) R60.1
NetIC6_K9: IC6.K9(GPIO[13]) R57.3
NetIC6_K10: IC6.K10(GPIO[12]) R57.1
NetIC6_K11: IC6.K11(GPIO[10]) R52.5
NetIC6_L10: IC6.L10(GPIO[11]) R52.7
NetIC8_1: IC8.1(S) J13.2 R81.2
NetIC8_3: IC8.3(W) R85.2
NetIC8_7: IC8.7(HOLD) R82.2
NetIC10_16: IC10.16(~{RST}) R91.2
NetIC12_3: IC12.3(~{RES}~{ET}) R88.2
NetJ12_10: J12.10 R80.1 R84.2

Not connected (* = marked no-connect by the designer): IC6 A11(NC)* C4(GPIO[57])* D1(GPIO[50])* D2(GPIO[51])* D3(GPIO[52])* D6(CLKIN_32)* D7(CLKIN)* D11(O[60])*; IC10 3(O1)* 11(~{INT})*; IC12 2(~{SS1}/GPIO1)* 10(~{SS2}/GPIO2)*; J11 11(Mechanical)*; J12 7* 9*; JMP1 1 2; R63 1* 3*

### Layout directives
differential pair: FX3_USB_D_N, FX3_USB_D_P, FX3_USB_SSRX_N, FX3_USB_SSRX_P, FX3_USB_SSTX_IC_N, FX3_USB_SSTX_IC_P, FX3_USB_SSTX_N, FX3_USB_SSTX_P, FX3_XTAL_N, FX3_XTAL_P
net class FX3_DATA: FX3_USB_D_N, FX3_USB_D_P, FX3_USB_SSRX_N, FX3_USB_SSRX_P, FX3_USB_SSTX_IC_N, FX3_USB_SSTX_IC_P, FX3_USB_SSTX_N, FX3_USB_SSTX_P
net class FX3_CTL: FX3_CTL0, FX3_CTL1, FX3_CTL2, FX3_CTL3, FX3_CTL4, FX3_CTL5, FX3_CTL6, FX3_CTL7, FX3_CTL8, FX3_CTL9, FX3_CTL10, FX3_CTL11, FX3_CTL12
net class FX3_DQ: FX3_DQ0, FX3_DQ1, FX3_DQ2, FX3_DQ3, FX3_DQ4, FX3_DQ5, FX3_DQ6, FX3_DQ7, FX3_DQ8, FX3_DQ9, FX3_DQ10, FX3_DQ11, FX3_DQ12, FX3_DQ13, FX3_DQ14, FX3_DQ15, FX3_DQ16, FX3_DQ17, FX3_DQ18, FX3_DQ19, FX3_DQ20, FX3_DQ21, FX3_DQ22, FX3_DQ23, FX3_DQ24, FX3_DQ25, FX3_DQ26, FX3_DQ27, FX3_DQ28, FX3_DQ29, FX3_DQ30, FX3_DQ31, FX3_PCLK
net class I2C_BRDG: BRDG_INT, BRDG_SPI_DUMMY_SS, BRDG_SPI_FPGA_SS, BRDG_SPI_MISO, BRDG_SPI_MOSI, BRDG_SPI_SCLK
net class FX3_JTAG: FX3_JTAG_TCK, FX3_JTAG_TDI, FX3_JTAG_TDO, FX3_JTAG_TMS, FX3_JTAG_TRST, FX3_RST
net class FPGA_CONFIG: EXP_CONF_DONE, EXP_NCONFIG, EXP_NSTATUS, FPGA_CONF_DONE, FPGA_NCONFIG, FPGA_NSTATUS

### Notes on the sheet
- Number of NF elements on sheet: 6
- NF elements on sheet: R53, R71, R76, R79, R80, R84
- FX3 (USB3) core
- (near R53) NF
- (near R63) PCB note: FX3_DQ and FX_CTL lenghts must match
- (near R71) NF
- FX3 Misc
- FX3 memory
- FX3 JTAG (10 pin)
- (near J12) Pitch: 0.05" (1.27mm)
- FX3 Config
- SPI boot, On Failure - USB Boot
- Jumper    Boot from
- (near J13) 1-2        Flash
- (near J13) No        USB
- (near R79) NF
- (near R76) NF
- (near R84) NF
- NF
- (near R83) 19.2MHz crystal selection
- (near SW1) FX3 Reset
- I2C SPI Bridge
- I2C Port Expander
- I2C Temperature sensor
- I2C EEPROM
- (near IC12) I2C addr: [0 1 0 1 0 0 0 RW]
- (near IC10) I2C addr: [1 1 0 1 1 0 1 RW]
- I2C addr: [1 0 0 1 0 0 0 RW]
- (near IC11) I2C Address: [1 0 1 0 0 0 0 RW]
- PCB note: place between FPGA amd LMS
- Project name:
- Title:
- Size:
- Date:
- A3
- Revision:
- Time:
- Sheet
- of
- File:
- (in symbol M25P40) SOIC-8

### Library data of the parts
C130 C131 C136 C138-C142 = Cap_0603: as C298 on sheet 09_FPGA_misc; Supplier 1: Mouser; Supplier Part Number 1: 81-GRM155R71C104KA88; Tolerance: 10 %; Case Code - in: 0402; Manufacturer: Murata Electronics; Category: Multilayer Ceramic Capacitors MLCC - SMD/SMT; Value: 100nF, 10%; Manufacturer Part Number: GRM155R71C104KA88D
C132 = Cap_0402: Manufacturer: Murata Electronics; Manufacturer Part Number 1: GRM155R71C104KA88D; Part Description: 0.10µF ±10% 16V X7R Ceramic Capacitor -55°C ~ 125°C Surface Mount, MLCC 0402 (1005 Metric) 0.039" L x 0.020" W (1.00mm x 0.50mm); Voltage Rating DC: 16 V; Type: General Purpose MLCC; Capacitance: 0.1 uF; Case Length: 1 mm; Dielectric: X7R; Case Height: 0.5 mm; Temperature Coefficient / Code: +/- 15 %; Value: 100nF, 10%; Supplier 1: Mouser; Supplier Part Number 1: 81-GRM155R71C104KA88; Case Code - in: 0402; RoHS: RoHS Compliant; Operating Temperature Range: - 55 C to + 125 C; Series: GRM; Termination Style: SMD/SMT; Tolerance: 10 %; Package / Case: 0402 (1005 metric); Maximum Operating Temperature: + 125 C; Case Code - mm: 1005; Minimum Operating Temperature: - 55 C; Product Category: Low & Medium Capacitance SMD Ceramic Chip Capacitors; Packaging: Reel; Product: General Type MLCCs; Category: Multilayer Ceramic Capacitors MLCC - SMD/SMT; Brand: Murata Electronics; Case Width: 0.5 mm; RoHS - Mouser: Y; Standard Pack Qty: 10000; Minimum Order Quantity: 1; Reeling: True
C133 = Cap_0603: Manufacturer: Yageo; Manufacturer Part Number 1: CC0603KPX7R9BB103; Part Description: 10000pF ±10% 50V X7R Ceramic Capacitor -55°C ~ 125°C Surface Mount, MLCC 0603 (1608 Metric) 0.063" L x 0.031" W (1.60mm x 0.80mm); Temperature Coefficient: X7R; Voltage - Rated: 50V; Tolerance: ±10%; Capacitance: 10000pF; Supplier 1: Digi-Key; Supplier Part Number 1: 311-1572-1-ND; Mounting Type: Surface Mount, MLCC; Size / Dimension: 0.063" L x 0.031" W (1.60mm x 0.80mm); Package / Case: 0603 (1608 Metric); Lead Style: -; Ratings: -; Applications: General Purpose; Operating Temperature: -55°C ~ 125°C; Lead Spacing: -; Thickness (Max): 0.035" (0.90mm); Features: -; Height - Seated (Max): -; Category: Capacitors; Packaging: Cut Tape (CT); RoHS: RoHS Compliant; Value: 1uF
C134 = Cap_0603: Manufacturer: Murata; Manufacturer Part Number 1: GRM155R71C104KA88D; Part Description: 0.10µF ±10% 16V X7R Ceramic Capacitor -55°C ~ 125°C Surface Mount, MLCC 0402 (1005 Metric) 0.039" L x 0.020" W (1.00mm x 0.50mm); Brand: Murata Electronics; Type: General Purpose MLCC; Capacitance: 0.1 uF; Temperature Coefficient / Code: +/- 15 %; Voltage Rating DC: 16 V; Supplier 1: Mouser; Supplier Part Number 1: 81-GRM155R71C104KA88; Tolerance: 10 %; Case Code - in: 0402; Category: Multilayer Ceramic Capacitors MLCC - SMD/SMT; Value: 100nF, 10%
C135 C137 = Cap_0603: Manufacturer: Murata Electronics North America; Part Description: 13pF ±5% 50V C0G, NP0 Ceramic Capacitor -55°C ~ 125°C Surface Mount, MLCC 0402 (1005 Metric) 0.039" L x 0.020" W (1.00mm x 0.50mm); Voltage - Rated: 50V; Supplier 1: Digi-Key; Supplier Part Number 1: 490-5925-2-ND; Tolerance: ±5%; Capacitance: 13pF; Category: Capacitors; Package / Case: 0402 (1005 Metric); Value: 13pF, 5%
FR36 FR37 = Ferrite: Manufacturer: TDK Corporation; Part Description: FERRITE BEAD 220 OHM 0402 1LN; Manufacturer Part Number 1: MPZ1005S221ET000; Current Rating: 900mA; DC Resistance (DCR): 220 mOhm Max; Supplier 1: Digi-Key; Impedance @ Frequency: 220 Ohm @ 100MHz; Package / Case: 0402 (1005 Metric); Category: Filters; Supplier Part Number 1: 445-9329-2-ND; Value: 220 Ohm @ 100MHz
  FR37: Supplier Part Number: 445-9329-2-ND
IC6 = CYUSB3014-BZXC: EZ-USB(R) FX3: SuperSpeed USB Controller, 512 KB, 60 I/Os, 0 to 70 degC, 121-Pin FBGA (BZX121); Manufacturer: Cypress Semiconductor Corp; CPU Core: ARM926 EJ-S; Max. Operating Voltage (V): 1.25; Memory Architecture: SRAM; Memory Size (KB): 512; Min. Operating Voltage (V): 1.15; No. of I/Os: 60; DatasheetVersion: Rev. *O; PackageVersion: Rev. *D; PackageReference: BZX121; PackageDescription: 121-Ball FBGA, Body 10 x 10 mm, Pitch 0.8 mm; Supplier 1: Digi-Key; Supplier Part Number 1: 428-3182-ND; Supplier 2: Farnell; Supplier Part Number 2: 2355789; Supplier 3: Newark; Supplier Part Number 3: 54W7901; Supplier 4: Mouser; Supplier Part Number 4: 727-CYUSB3014-BZXC; Max. Operating Temp. (degreesC): 70; Min. Operating Temp. (degreesC): 0; RoHS: Pb-Free; Mounting Technology: Surface Mount; Code_JEDEC: PUB 95; PartNumber: CYUSB3014-BZXC; ComponentLink1Description: Manufacturer URL; ComponentLink1URL: http://www.cypress.com/; ComponentLink2Description: Datasheet; ComponentLink2URL: http://www.cypress.com/?docID=49087; ComponentLink3Description: Package Specification; ComponentLink3URL: http://www.cypress.com/?docID=45795; Part Description: EZ-USB(R) FX3: SuperSpeed USB Controller, 512 KB, 60 I/Os, 0 to 70 degC, 121-Pin FBGA (BZX121)
IC7 = SP3010-04UTG: Manufacturer: Littelfuse Inc; Part Description: TVS DIODE 6VWM 12.3VC UDFN; Supplier 1: Digi-Key; Category: Circuit Protection; Supplier Device Package: 10-µDFN (2.5x1.0); Supplier Part Number 1: F3507TR-ND; Manufacturer Part Number 1: SP3010-04UTG
IC8 = M25P40: Manufacturer: Micron Technology Inc; Part Description: IC FLASH 4MBIT 75MHZ 8SO; Manufacturer Part Number 1: M25P40-VMN6TPB; Memory Size: 4M (512K x 8); Voltage - Supply: 2.3 V ~ 3.6 V; Supplier 1: Digi-Key; Supplier Device Package: 8-SO; Supplier Part Number 1: M25P40-VMN6TPBTR-ND
IC9 = LM75: Manufacturer: NXP Semiconductors; Manufacturer Part Number: LM75BTP,147; Part Description: SENSOR TEMPERATURE I2C 8HWSON; Sensing Temperature - Local: -55°C ~ 125°C; Output Type: I²C; Accuracy - Highest (Lowest): ±2°C (±3°C); Voltage - Supply: 2.8 V ~ 5.5 V; Test Condition: -25°C ~ 100°C (-55°C ~ 125°C); Sensor Type: Digital, Local; Resolution: 10 b; Supplier 1: Digi-Key; Operating Temperature: -55°C ~ 125°C; Features: Output Switch, Programmable Limit, Shutdown Mode; Supplier Device Package: 8-HWSON (2x3); Sensing Temperature - Remote: -; Category: Sensors, Transducers; Packaging: Tape & Reel (TR); RoHS: RoHS Compliant; Package / Case: 8-WFDFN Exposed Pad; Supplier Part Number 1: 568-9815-2-ND
IC10 = MAX7322ATE+: Manufacturer: Maxim Integrated; Part Description: IC I/O EXPANDER I2C 4B 16TQFN; Interface: I²C; Number of I/O: 4 (Input Only); Voltage - Supply: 1.7 V ~ 5.5 V; Interrupt Output: Yes; Current - Output Source/Sink: 20mA; Frequency - Clock: 400kHz; Supplier 1: Digi-Key; Mounting Type: Surface Mount; Category: Integrated Circuits (ICs); RoHS: RoHS Compliant; Packaging: Tube; Manufacturer Part Number: MAX7322ATE+; Supplier Device Package: 16-TQFN-EP (3x3); Package / Case: 16-WFQFN Exposed Pad; Operating Temperature: -40°C ~ 125°C; Features: POR; Output Type: -; Supplier Part Number 1: MAX7322ATE+-ND
IC11 = 24FC64F: Manufacturer Part Number 1: 24FC64F-I/ST; Manufacturer: Microchip Technology; Part Description: IC EEPROM 512KBIT 1MHZ 8TSSOP; Format - Memory: EEPROMs - Serial; Speed: 400kHz, 1MHz; Interface: I²C, 2-Wire Serial; Memory Type: EEPROM; Memory Size: 64K (8K x 8); Voltage - Supply: 1.7 V ~ 5.5 V; Supplier 1: Digi-Key; Packaging: Tube; Supplier Device Package: 8-TSSOP; Operating Temperature: -40°C ~ 85°C; RoHS: RoHS Compliant; Category: Integrated Circuits (ICs); Package / Case: 8-TSSOP (0.173", 4.40mm Width); Supplier Part Number 1: 24FC64F-I/ST-ND
IC12 = SC18IS602: Manufacturer Part Number 1: SC18IS602BIPW,112; Manufacturer: NXP Semiconductors; Part Description: IC BRIDGE SPI/I2C 16-TSSOP; Interface: SPI; Voltage - Supply: 2.4 V ~ 3.6 V; Current - Supply: 11mA; Function: Controller; Protocol: I²C; Standards: -; Operating Temperature: -40°C ~ 85°C; RoHS: RoHS Compliant; Packaging: Tube; Category: Integrated Circuits (ICs); Supplier Device Package: 16-TSSOP; Package / Case: 16-TSSOP (0.173", 4.40mm Width); Supplier 1: Digi-Key; Supplier Part Number 1: 568-4785-5-ND
J11 = USB3.0_MALE: Manufacturer Part Number 1: USB1065-30-A; Manufacturer: GLOBAL CONNECTOR TECHNOLOGY; Part Description: USB1065-30-A  USB, 3.0 TYPE A, PLUG, SMT; Supplier 1: Farnell; Supplier Part Number 1: 2443106; RoHS: YES
J12 = Header 5X2_SWD: as J17 on sheet 09_FPGA_misc; Supplier 1: Digi-Key; Contact Mating Length: 0.118" (3.00mm); Category: Connectors, Interconnects; Color: Black; RoHS: RoHS Compliant; Number of Rows: 2; Contact Finish Thickness: 3µin (0.08µm); Height Stacking (Mating): -; Contact Finish: Gold; Termination: Solder; Mounting Type: Surface Mount; Pitch: 0.050" (1.27mm); Features: -; Packaging: Bulk; Supplier Part Number 1: 952-1389-ND
J13 = Jumper: Manufacturer Part Number 1: GRPB021VWVN-RC; Manufacturer: Sullins Connector Solutions; Part Description: 2 Positions Header, Unshrouded Connector 0.050" (1.27mm) Through Hole Gold; Connector Type: Header, Unshrouded; Number of Positions: 2; Number of Positions Loaded: All; Pitch: 0.050" (1.27mm); Supplier 1: Digi-Key; Supplier Part Number 1: S9014E-02-ND; Contact Mating Length: 0.118" (3.00mm); Mounting Type: Through Hole; Termination: Solder; Fastening Type: -; Features: -; Contact Finish: Gold; Contact Finish Thickness: Flash; Color: -; Category: Connectors, Interconnects; RoHS: RoHS Compliant; Packaging: Bulk; Contact Type: Male Pin; Number of Rows: 1; Row Spacing: -
JMP1 = JUMP_2P_CONN_HEADER: Shorting Jumper, 2-position, 1.27mm pitch; Manufacturer Part Number 1: M50-2030005; Manufacturer: Harwin Inc.; Part Description: CONN SHUNT 1.27MM BLUE W/HANDLE; Gender: Female Sockets; Number of Positions or Pins (Grid): 2 (1 x 2); Pitch: 0.050" (1.27mm); Supplier 1: Digi-Key; Supplier Part Number 1: 952-1732-ND; Category: Connectors, Interconnects; RoHS: RoHS Compliant; Packaging: Bulk; Type: Closed Top, Grip; Height: 0.217" (5.50mm); Contact Finish: Gold; Contact Finish Thickness: 1µin (0.025µm); Color: Blue
R48-R52 R55 R57 R58 R61-R63 = ResArray_0802: Part Description: RES ARRAY 4 RES 22 OHM 0804; Manufacturer: Yageo; Manufacturer Part Number 1: YC124-JR-0722RL; Temperature Coefficient: ±200ppm/°C; Tolerance: ±5%; Supplier 1: Digi-Key; Supplier Part Number 1: YC124J-22TR-ND; Package / Case: 0804, Convex, Long Side Terminals; Value: 22R
R53 = Res_0402: Manufacturer: Yageo; Part Description: RES SMD 0.0OHM JUMPER 1/16W 0402; Manufacturer Part Number 1: RC0402JR-070RL; Supplier 1: Digi-Key; Supplier Part Number 1: 311-0.0JRTR-ND; Composition: Thick Film; Package / Case: 0402 (1005 Metric); Category: Resistors; Value: 0R
R54 = Res_0402: Manufacturer: Rohm Semiconductor; Manufacturer Part Number 1: MCR01MRTF6041; Part Description: RES SMD 6.04K OHM 1% 1/16W 0402; Temperature Coefficient: ±100ppm/°C; Supplier Part Number 1: RHM6.04KCDTR-ND; Supplier 1: Digi-Key; Category: Resistors; Supplier Device Package: 0402 (1005 Metric); Composition: Thick Film; Tolerance: ±1%; Value: 6.04K, 1%
R56 = Res_0402: Manufacturer: Stackpole Electronics Inc; Part Description: RES SMD 200 OHM 1% 1/16W 0402; Power (Watts): 0.063W, 1/16W; Resistance (Ohms): 200; Temperature Coefficient: ±100ppm/°C; Supplier 1: Digi-Key; Supplier Device Package: 0402; Composition: Thick Film; Category: Resistors; Tolerance: ±1%; Supplier Part Number 1: RMCF0402FT200RDKR-ND; Value: 200R, 1%
R59 R60 = Res_0402: as R186 on sheet 09_FPGA_misc; Supplier 1: Digi-Key; Supplier Part Number 1: 311-22.0LRTR-ND; Supplier Device Package: 0402; Composition: Thick Film; Category: Resistors; Value: 22R
R64-R66 R75-R77 R79 R83 R86-R92 = Res_0402: as R176 on sheet 09_FPGA_misc; Value: 10k, 1%; Supplier 1: Digi-Key; Supplier Part Number 1: 311-10.0KLRTR-ND; Resistance (Ohms): 10k; Packaging: Tape & Reel (TR); RoHS: RoHS Compliant; Package / Case: 0402 (1005 Metric); Tolerance: ±1%; Operating Temperature: -55°C ~ 155°C; Size / Dimension: 0.039" L x 0.020" W (1.00mm x 0.50mm); Number of Terminations: 2; Category: Resistors; Height: 0.016" (0.40mm); Supplier Device Package: 0402; Features: Moisture Resistant; Composition: Thick Film
R67-R73 R80 = Res_0402: as R168 on sheet 09_FPGA_misc; Supplier 1: Digi-Key; Supplier Part Number 1: 311-0.0JRTR-ND; Composition: Thick Film; Package / Case: 0402 (1005 Metric); Category: Resistors; Value: 0R
R74 R78 = Res_0402: as R187 on sheet 09_FPGA_misc; Value: 100K; Supplier 1: Digi-Key; Supplier Part Number 1: P100KJCT-ND; Resistance (Ohms): 100k; Composition: Thick Film; Features: Automotive AEC-Q200; Number of Terminations: 2; Height: 0.016" (0.40mm); RoHS: RoHS Compliant; Package / Case: 0402 (1005 Metric); Packaging: Cut Tape (CT); Size / Dimension: 0.039" L x 0.020" W (1.00mm x 0.50mm); Supplier Device Package: 0402; Operating Temperature: -55°C ~ 155°C; Category: Resistors
R81 R82 R85 = Res_0402: as R188 on sheet 09_FPGA_misc; Supplier 1: Digi-Key; Composition: Thick Film; Supplier Device Package: 0402; Supplier: Digi-Key; Supplier Part Number 1: RMCF0402JT4K70TR-ND; Category: Resistors; Value: 4K7
R84 = Res_0402: Manufacturer Part Number 1: RC0402JR-070RL; Manufacturer: Yageo; Part Description: RES SMD 0.0OHM JUMPER 1/16W 0402; Resistance (Ohms): 0.0; Tolerance: Jumper; Power (Watts): 0.063W, 1/16W; Value: 0R; Supplier 1: Digi-Key; Supplier Part Number 1: 311-0.0JRTR-ND; Category: Resistors; Temperature Coefficient: -; Features: Moisture Resistant; Supplier Device Package: 0402; Height: 0.016" (0.40mm); Package / Case: 0402 (1005 Metric); Operating Temperature: -55°C ~ 155°C; Size / Dimension: 0.039" L x 0.020" W (1.00mm x 0.50mm); Composition: Thick Film; Packaging: Tape & Reel (TR); Number of Terminations: 2; RoHS: RoHS Compliant
R93 R94 = Res_0402: as R180 on sheet 09_FPGA_misc; Value: 1k, 1%; Supplier 1: Digi-Key; Supplier Part Number 1: RMCF0402FT1K00TR-ND; Package / Case: 0402 (1005 Metric); Supplier Device Package: 0402; Height: 0.016" (0.40mm); Size / Dimension: 0.039" L x 0.020" W (1.00mm x 0.50mm); Number of Terminations: 2; Packaging: Cut Tape (CT); Category: Resistors; Composition: Thick Film; Resistance (Ohms): 1k; Tolerance: ±1%; Features: Moisture Resistant; Operating Temperature: -55°C ~ 155°C; RoHS: RoHS Compliant
SW1 = Button: Part Description: SWITCH TACTILE SPST-NO 0.05A 12V; Manufacturer: Omron Electronics Inc-EMC Div; Manufacturer Part Number 1: B3U-1000P; Outline: 3.00mm x 2.50mm; Actuator Type: Standard; Mechanical Life: 200,000 Cycles; Actuator Orientation: Top Actuated; Supplier 1: Digi-Key; Supplier Part Number 1: SW1020TR-ND; Category: Switches
XT1 = CRYSTAL_19M2: Oscillator Crystal 19.2 MHz; Manufacturer Part Number 1: 405C35B19M20000; Manufacturer: CTS-Frequency Controls; Part Description: 19.2MHz ±30ppm Crystal 13pF 60 Ohm -20°C ~ 70°C Surface Mount 4-SMD, No Lead (DFN, LCC); Frequency Tolerance: ±30ppm; ESR (Equivalent Series Resistance): 60 Ohm; Load Capacitance: 13pF; Frequency Stability: ±50ppm; Operating Mode: Fundamental; Supplier 1: Digi-Key; Supplier Part Number 1: CTX648CT-ND; Height: 0.041" (1.05mm); Category: Crystals and Oscillators; Package / Case: 4-SMD, No Lead (DFN, LCC); Mounting Type: Surface Mount; Operating Temperature: -20°C ~ 70°C; Size / Dimension: 0.197" L x 0.126" W (5.00mm x 3.20mm); Frequency: 19.2MHz